# EasyEDA Pro project stepprobetojtag.epro

# Schematic Schematic1
Board Name: Board1; Create Date: 2025-06-05; Page Name: P1; Project Name: StepProbeToJTAG; Schematic Name: Schematic1; Update Date: 2025-06-05; Company: 嘉立创EDA; Page Size: A4; Version: V1.0
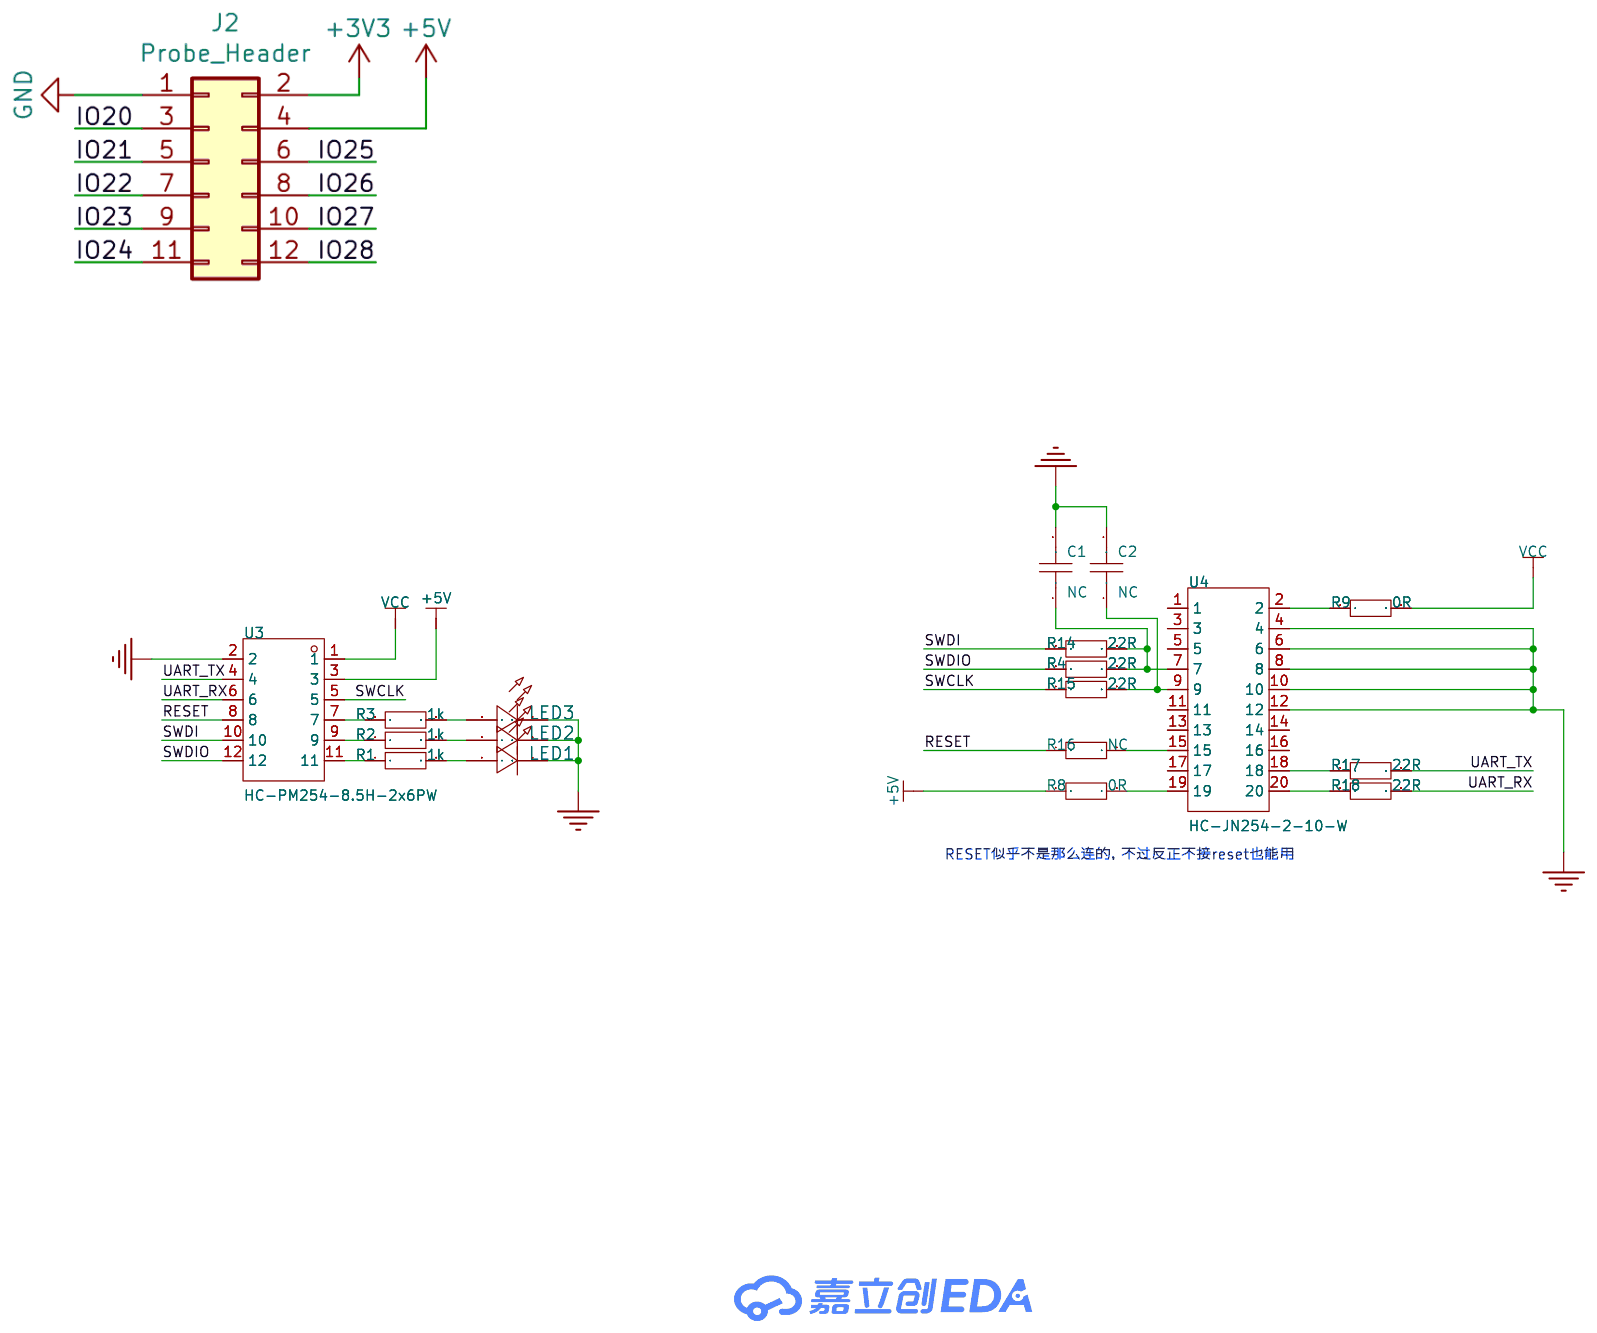
[diagram p0: schematic sheet]

## Parts
C1  NC  [C0603]
C2  NC  [C0603]
LED1  -  [LED_0603]
LED2  -  [LED_0603]
LED3  -  [LED_0603]
R1  1k  [R0603]
R2  1k  [R0603]
R3  1k  [R0603]
R4  22R  [R0603]
R8  0R  [R0603]
R9  0R  [R0603]
R14  22R  [R0603]
R15  22R  [R0603]
R16  NC  [R0603]
R17  22R  [R0603]
R18  22R  [R0603]
U3  HC-PM254-8.5H-2x6PW  [CONN-TH_HC-PM254-8.5H-2X6PW]
U4  HC-JN254-2-10-W  [HDR-TH_HC-JN254-2-10-W]

## Library data of the parts
C1 C2 = CAP_0603: Supplier Footprint: 0603
LED1-LED3 = LED_0603-R: Supplier Footprint: 0603
R1-R4 R8 R9 R14-R18 = Res_0603: Supplier Footprint: 0603
U3 = HC-PM254-8.5H-2x6PW: 插孔结构:2x6P;间距:2.54mm;行距:2.54mm;圆孔/方孔:方孔;安装方式:弯插;排数:双排;总孔位数:12P;额定电流:3A;额定电压:-;插孔方向:侧面;塑高:5mm;触头材质:黄铜;触头镀层:金;工作温度:-40℃~+105℃;; LCSC Part Name: 间距2.54mm 2x6Pin 弯插 PC3.2 PB12.7 H8.5; Supplier Part: C22373932; Manufacturer: HC(虹成电子); Supplier Footprint: 弯插,P=2.54mm; JLCPCB Part Class: 扩展库; Datasheet: https://atta.szlcsc.com/upload/public/pdf/source/20250106/44A3763239922CF549F753A327E63AF6.pdf; Supplier: LCSC; Holes Structure: 2x6P; Pitch: 2.54mm; Row Spacing: 2.54mm; Circular Hole / Square Hole: 方孔; Mounting Type: 弯插; Number of Rows: 双排; Number of Positions: 12P; Current Rating: 3A; Holes Direction: 侧面; Insulation Height: 5mm; Contact Material: 黄铜; Contact Plating: 金; Operating Temperature: -40℃~+105℃; PIN Length: 3mm
U4 = HC-JN254-2-10-W: 连接器类型:简牛座;间距:2.54mm;结构:2x10P;额定电流:3A;额定电压:-;封装形式:弯插;行距:2.54mm;排数:2;每排PIN数:10;触头材质:黄铜;触头镀层:金;工作温度范围:-40℃~+105℃;焊接温度(最大值):260℃@10S;; LCSC Part Name: 2.54mm 2x10P 排数:2 每排P数:10; Supplier Part: C5372876; Manufacturer: HCTL(华灿天禄); Supplier Footprint: 弯插,P=2.54mm; JLCPCB Part Class: 扩展库; Datasheet: https://atta.szlcsc.com/upload/public/pdf/source/20230314/29278A24539954283B80828B9C32CD4C.pdf; Supplier: LCSC; Connector Type: 简牛座; Pitch: 2.54mm; Structure: 2x10P; Current Rating (Max): 3A; Holder Type: 弯插; Row Spacing: 2.54mm; Number of Rows: 2; Pin Number in each Row: 10; Contact Material: 黄铜; Contact Plating: 金; Operating Temperature Range: -40℃~+105℃; Soldering Temperature(Max): 260℃@10S

## Nets
+5V: R8.1 U3.3
GND: C1.2 C2.2 LED1.1(C) LED2.1(C) LED3.1(C) U3.2 U4.4 U4.6 U4.8 U4.10 U4.12
VCC: R9.2 U3.1
RESET: R16.1 U3.8
SWCLK: R15.1 U3.5
SWDI: R14.1 U3.10
SWDIO: R4.1 U3.12
UART_RX: R18.2 U3.6
UART_TX: R17.2 U3.4
$1N203: R1.1 U3.11
$1N204: LED1.2(A) R1.2
$1N656: R2.1 U3.9
$1N657: LED2.2(A) R2.2
$1N707: R3.1 U3.7
$1N708: LED3.2(A) R3.2
$1N1104: C1.1 R4.2 R14.2 U4.7
$1N1105: C2.1 R15.2 U4.9
$1N1119: R16.2 U4.15
$1N1122: R8.2 U4.19
$1N1125: R9.1 U4.2
$1N1127: R17.1 U4.18
$1N1128: R18.1 U4.20

Not connected (* = marked no-connect by the designer): U4 1 3 5 11 13 14 16 17

## Notes on the sheet
- RESET似乎不是那么连的，不过反正不接reset也能用

# Board PCB1
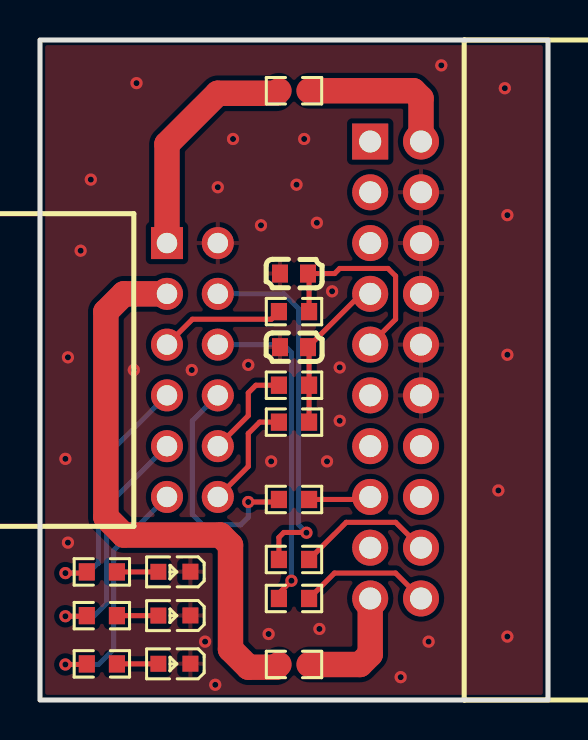
[diagram p1: board, top side]
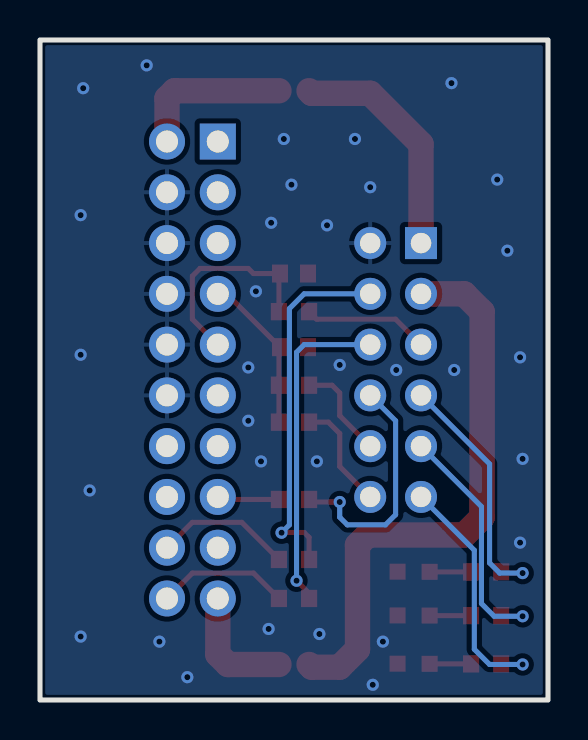
[diagram p2: board, bottom side, seen from below]

Outline 25.4 x 33.02 mm; copper layers: Top Layer, Bottom Layer. Coordinates in mm from the lower left corner of the outline.
Outline path: rectangle 0,33.02 25.4,0
Stack: Top Layer 0.035mm / Dielectric1 1.51mm FR4 er 4.5 / Bottom Layer 0.035mm

## Design rules (mm)
template: JLCPCB Capability(Two Layers Board)
spacing copperThickness1oz (default): track to track 0.102, other pairs 0.152 to 0.3
spacing copperThickness2oz: track to track 0.203, other pairs 0.152 to 0.3
track width copperThickness1oz (default): min 0.127, default 0.254, max 2.54
track width copperThickness2oz: min 0.203, default 0.254, max 2.54
differential pair differentialPair (default): width min 0.127, default 0.254, max 2.54; gap min 0.152, default 0.152
via viaSize (default): diameter min 0.5, default 0.61, max 10; hole min 0.3, default 0.305, max 6.3

## Placement (name value [footprint] x y rotation side)
C1  NC  [C0603]  12.7 17.65 180 top
C2  NC  [C0603]  12.7 21.34 180 top
LED1  -  [LED_0603]  6.67 1.81 180 top
LED2  -  [LED_0603]  6.67 4.22 180 top
LED3  -  [LED_0603]  6.67 6.41 180 top
R1  1k  [R0603]  3.09 1.81 0 top
R2  1k  [R0603]  3.09 4.22 0 top
R3  1k  [R0603]  3.09 6.41 0 top
R4  22R  [R0603]  12.7 13.9 0 top
R8  0R  [R0603]  12.7 1.78 0 top
R9  0R  [R0603]  12.7 30.48 180 top
R14  22R  [R0603]  12.7 15.75 0 top
R15  22R  [R0603]  12.7 19.43 0 top
R16  NC  [R0603]  12.7 10.03 0 top
R17  22R  [R0603]  12.7 7.03 180 top
R18  22R  [R0603]  12.7 5.08 180 top
U3  HC-PM254-8.5H-2x6PW  [CONN-TH_HC-PM254-8.5H-2X6PW]  7.62 16.51 270 top
U4  HC-JN254-2-10-W  [HDR-TH_HC-JN254-2-10-W]  17.78 16.51 90 top

## Footprints (pads in the part's own frame, mm; a bottom-side part is the same pattern mirrored in y, then rotated)
C0603
  rect 0.8x0.9 smd: 1(-0.7,0) 2(0.7,0)
CONN-TH_HC-PM254-8.5H-2X6PW
  rect 1.6x1.6 hole 1.02: 1(-6.35,-1.27)
  round 1.6 hole 1.02: 2(-6.35,1.27) 3(-3.81,-1.27) 4(-3.81,1.27) 5(-1.27,-1.27) 6(-1.27,1.27) 7(1.27,-1.27) 8(1.27,1.27) 9(3.81,-1.27) 10(3.81,1.27) 11(6.35,-1.27) 12(6.35,1.27)
HDR-TH_HC-JN254-2-10-W
  rect 1.8x1.8 hole 1.1: 1(11.43,1.27)
  round 1.8 hole 1.1: 2(11.43,-1.27) 3(8.89,1.27) 4(8.89,-1.27) 5(6.35,1.27) 6(6.35,-1.27) 7(3.81,1.27) 8(3.81,-1.27) 9(1.27,1.27) 10(1.27,-1.27) 11(-1.27,1.27) 12(-1.27,-1.27) 13(-3.81,1.27) 14(-3.81,-1.27) 15(-6.35,1.27) 16(-6.35,-1.27) 17(-8.89,1.27) 18(-8.89,-1.27) 19(-11.43,1.27) 20(-11.43,-1.27)
LED_0603
  rect 0.8x0.8 smd: 1(-0.851,-0.01) 2(0.75,-0.005)
R0603
  rect 0.806x0.864 smd: 1(-0.753,0) 2(0.753,0)

## Nets
As in the schematic.

Pads without a net: U4 1 3 5 11 13 14 16 17

## Via types
v1: diameter 0.61, hole 0.305, Top Layer to Bottom Layer, 38 vias

## Routing (per net, layer and track width the routed paths; a pad name or vN(x,y) marks a point on that pad's centre or on a via; arc(x,y) is an arc through that point)
+5V: length 28.6
  Top Layer w1.27: U3.3 4.19,20.32 3.29,19.42 3.29,9.15 4.19,8.25 9.02,8.25 9.53,7.75 9.53,2.54 10.42,1.64 11.81,1.64 R8.1
GND:
  vias: v1(1.27,12.06) v1(1.4,17.14) v1(1.4,7.87) v1(2.03,22.48) v1(2.54,26.03) v1(4.69,16.51) v1(4.83,30.86) v1(7.59,16.51) v1(8.25,2.92) v1(8.76,0.76) v1(8.89,25.65) v1(9.65,28.07) v1(10.41,16.76) v1(11.05,23.75) v1(11.43,3.3) v1(11.56,11.94) v1(12.83,25.78) v1(13.21,28.07) v1(13.84,23.88) v1(13.97,3.56) v1(14.35,11.94) v1(14.6,20.45) v1(14.99,16.64) v1(14.99,13.97) v1(18.03,1.14) v1(19.43,2.92) v1(20.07,31.75) v1(22.92,10.48) v1(23.24,30.61) v1(23.37,24.26) v1(23.37,17.27) v1(23.37,3.17)
VCC: length 11.7
  Top Layer w1.27: U3.1 6.35,27.81 8.89,30.35 11.82,30.35 R9.2
RESET: length 12
  Top Layer w0.254: R16.1 11.82,9.91 v1(10.41,9.91)
  Bottom Layer w0.254: U3.8 7.62,13.97 7.62,9.27 8.13,8.76 10.03,8.76 10.41,9.14 v1(10.41,9.91)
SWCLK: length 6.3
  Top Layer w0.254: R15.1 11.57,19.05 7.62,19.05 U3.5
SWDI: length 5
  Top Layer w0.254: U3.10 10.41,14.22 10.41,15.37 10.79,15.75 R14.1
SWDIO: length 5.6
  Top Layer w0.254: R4.1 10.98,13.9 10.41,13.33 10.41,11.68 U3.12
UART_RX: length 16.4
  Top Layer w0.254: v1(12.57,5.97) 11.95,5.34 R18.2
  Bottom Layer w0.254: U3.6 12.19,17.78 12.57,17.4 v1(12.57,5.97)
UART_TX: length 18.3
  Top Layer w0.254: R17.2 11.95,8.14 12.19,8.38 13.31,8.38 v1(13.32,8.37)
  Bottom Layer w0.254: v1(13.32,8.37) 12.93,8.76 12.93,19.58 12.19,20.32 U3.4
$1N203: length 12.5
  Top Layer w0.254: R1.1 2.31,1.78 v1(1.27,1.78)
  Bottom Layer w0.254: v1(1.27,1.78) 2.92,1.78 3.68,2.54 3.68,7.49 U3.11
$1N204: length 2.1
  Top Layer w0.254: R1.2 5.91,1.81 5.92,1.81
$1N656: length 12.5
  Top Layer w0.254: R2.1 2.31,4.19 v1(1.27,4.19)
  Bottom Layer w0.254: v1(1.27,4.19) 2.69,4.19 3.33,4.83 3.33,9.68 U3.9
$1N657: length 2.1
  Top Layer w0.254: R2.2 5.91,4.22 5.92,4.23
$1N707: length 12.8
  Top Layer w0.254: R3.1 2.28,6.35 v1(1.27,6.35)
  Bottom Layer w0.254: U3.7 2.92,11.81 2.92,6.86 2.41,6.35 v1(1.27,6.35)
$1N708: length 2.1
  Top Layer w0.254: 5.92,6.41 5.91,6.41 R3.2
$1N1104: length 8
  Top Layer w0.254: R4.2 13.45,17.6 C1.1 16.07,20.32 U4.7
$1N1105: length 10.5
  Top Layer w0.254: U4.9 17.78,19.05 17.78,21.21 17.4,21.59 14.99,21.59 14.73,21.34 C2.1 13.45,21.28 R15.2
$1N1119: length 3.1
  Top Layer w0.254: U4.15 16.38,10.03 R16.2
$1N1122: length 6.1
  Top Layer w1.27: R8.2 16,1.78 16.51,2.29 U4.19
$1N1125: length 7.9
  Top Layer w1.27: U4.2 19.05,30.1 18.67,30.48 R9.1
$1N1127: length 6.9
  Top Layer w0.254: R17.1 15.31,8.89 17.78,8.89 U4.18
$1N1128: length 6.6
  Top Layer w0.254: U4.20 17.78,6.35 14.72,6.35 R18.1

## Copper pours and planes (outline as drawn; the poured copper is in the pictures)
GND on Top Layer: 0,33.02 25.4,33.02 25.4,0 0,0
GND on Bottom Layer: 0,33.02 25.4,33.02 25.4,0 0,0
